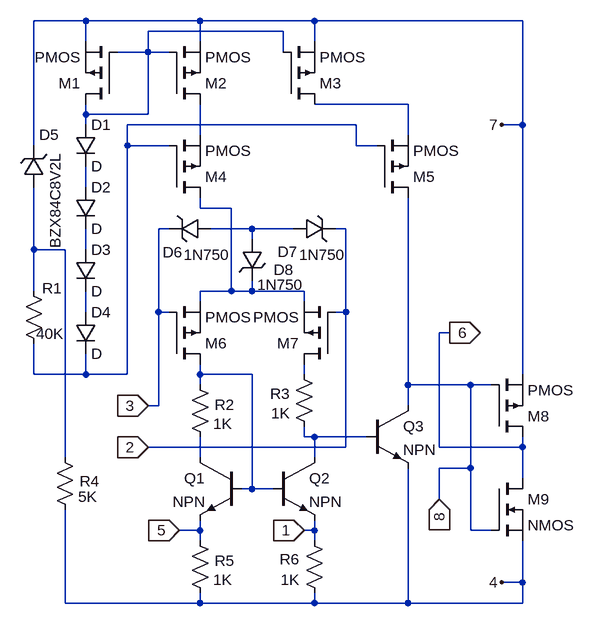
[diagram p0: schematic Ca3130.asc]
Ca3130.asc, the LTspice schematic file:
Version 4
SHEET 1 880 988
WIRE -224 256 -224 64
WIRE -224 416 -224 320
WIRE -224 480 -224 416
WIRE -224 608 -224 560
WIRE -176 416 -224 416
WIRE -176 736 -176 416
WIRE -176 960 -176 816
WIRE -144 64 -224 64
WIRE -144 96 -144 64
WIRE -144 208 -144 192
WIRE -144 224 -144 208
WIRE -144 320 -144 288
WIRE -144 416 -144 384
WIRE -144 512 -144 480
WIRE -144 608 -224 608
WIRE -144 608 -144 576
WIRE -80 256 -80 224
WIRE -80 608 -144 608
WIRE -80 608 -80 256
WIRE -48 112 -96 112
WIRE -48 112 -48 80
WIRE -48 208 -144 208
WIRE -48 208 -48 112
WIRE -32 512 -32 384
WIRE -32 656 -48 656
WIRE -32 656 -32 512
WIRE -16 112 -48 112
WIRE -16 256 -80 256
WIRE -16 384 -32 384
WIRE -16 512 -32 512
WIRE 32 64 -144 64
WIRE 32 96 32 64
WIRE 32 240 32 192
WIRE 32 352 32 336
WIRE 32 496 32 480
WIRE 32 608 32 592
WIRE 32 624 32 608
WIRE 32 736 32 704
WIRE 32 848 0 848
WIRE 32 848 32 832
WIRE 32 864 32 848
WIRE 32 960 -176 960
WIRE 32 960 32 944
WIRE 80 352 32 352
WIRE 80 480 32 480
WIRE 80 480 80 352
WIRE 112 384 48 384
WIRE 112 400 112 384
WIRE 112 480 80 480
WIRE 112 480 112 464
WIRE 112 608 32 608
WIRE 112 784 96 784
WIRE 112 784 112 608
WIRE 144 784 112 784
WIRE 160 80 -48 80
WIRE 160 112 160 80
WIRE 176 384 112 384
WIRE 192 480 112 480
WIRE 192 496 192 480
WIRE 192 608 192 592
WIRE 192 704 192 688
WIRE 208 64 32 64
WIRE 208 96 208 64
WIRE 208 704 192 704
WIRE 208 736 208 704
WIRE 208 848 192 848
WIRE 208 848 208 832
WIRE 208 864 208 848
WIRE 208 960 32 960
WIRE 208 960 208 944
WIRE 256 384 240 384
WIRE 256 512 240 512
WIRE 256 512 256 384
WIRE 256 720 -48 720
WIRE 256 720 256 512
WIRE 272 224 -80 224
WIRE 272 256 272 224
WIRE 288 704 208 704
WIRE 304 256 272 256
WIRE 352 192 208 192
WIRE 352 240 352 192
WIRE 352 624 352 336
WIRE 352 656 352 624
WIRE 352 960 208 960
WIRE 352 960 352 752
WIRE 400 720 400 544
WIRE 400 800 400 752
WIRE 416 544 400 544
WIRE 448 624 352 624
WIRE 448 752 400 752
WIRE 448 752 448 624
WIRE 448 848 448 752
WIRE 480 624 448 624
WIRE 480 848 448 848
WIRE 528 64 208 64
WIRE 528 224 496 224
WIRE 528 224 528 64
WIRE 528 608 528 224
WIRE 528 720 400 720
WIRE 528 720 528 704
WIRE 528 768 528 720
WIRE 528 928 496 928
WIRE 528 928 528 864
WIRE 528 960 352 960
WIRE 528 960 528 928
FLAG -48 656 3
IOPIN -48 656 In
FLAG -48 720 2
IOPIN -48 720 In
FLAG 0 848 5
IOPIN 0 848 In
FLAG 192 848 1
IOPIN 192 848 In
FLAG 400 800 8
IOPIN 400 800 In
FLAG 496 928 4
FLAG 496 224 7
FLAG 416 544 6
IOPIN 416 544 Out
SYMBOL zener -208 320 R180
WINDOW 0 -23 81 Left 0
WINDOW 3 -17 -94 VRight 0
SYMATTR InstName D5
SYMATTR Value BZX84C8V2L
SYMBOL res -208 576 R180
WINDOW 0 -12 116 Bottom 0
WINDOW 3 -9 15 Top 0
SYMATTR InstName R1
SYMATTR Value 40K
SYMATTR SpiceLine tol=1 pwr=0.1
SYMBOL zener 48 368 R90
WINDOW 0 68 58 VBottom 0
WINDOW 3 40 6 VTop 0
SYMATTR InstName D6
SYMATTR Value 1N750
SYMBOL zener 176 400 R270
WINDOW 0 -35 -9 VTop 0
WINDOW 3 -8 44 VBottom 0
SYMATTR InstName D7
SYMATTR Value 1N750
SYMBOL zener 96 400 R0
WINDOW 0 49 47 Left 0
WINDOW 3 24 70 Left 0
SYMATTR InstName D8
SYMATTR Value 1N750
SYMBOL res 16 608 R0
WINDOW 0 38 47 Left 0
SYMATTR InstName R2
SYMATTR Value 1K
SYMATTR SpiceLine tol=1 pwr=0.1
SYMBOL res 176 592 R0
WINDOW 0 -36 46 Left 0
WINDOW 3 -35 76 Left 0
SYMATTR InstName R3
SYMATTR Value 1K
SYMATTR SpiceLine tol=1 pwr=0.1
SYMBOL res -192 720 R0
WINDOW 0 39 52 Left 0
SYMATTR InstName R4
SYMATTR Value 5K
SYMATTR SpiceLine tol=1 pwr=0.1
SYMBOL npn2 144 736 R0
SYMATTR InstName Q2
SYMBOL npn2 96 736 M0
SYMATTR InstName Q1
SYMBOL res 16 848 R0
WINDOW 0 38 47 Left 0
SYMATTR InstName R5
SYMATTR Value 1K
SYMATTR SpiceLine tol=1 pwr=0.1
SYMBOL res 192 848 R0
WINDOW 0 -38 44 Left 0
WINDOW 3 -36 76 Left 0
SYMATTR InstName R6
SYMATTR Value 1K
SYMATTR SpiceLine tol=1 pwr=0.1
SYMBOL npn2 288 656 R0
SYMATTR InstName Q3
SYMBOL diode -160 224 R0
SYMATTR InstName D1
SYMBOL diode -160 320 R0
SYMATTR InstName D2
SYMBOL diode -160 416 R0
SYMATTR InstName D3
SYMBOL diode -160 512 R0
SYMATTR InstName D4
SYMBOL pmos -96 192 R180
SYMATTR InstName M1
SYMBOL pmos -16 192 M180
SYMATTR InstName M2
SYMBOL pmos 160 192 M180
SYMATTR InstName M3
SYMBOL pmos -16 336 M180
SYMATTR InstName M4
SYMBOL pmos 304 336 M180
SYMATTR InstName M5
SYMBOL pmos -16 592 M180
SYMATTR InstName M6
SYMBOL pmos 240 592 R180
SYMATTR InstName M7
SYMBOL pmos 480 704 M180
SYMATTR InstName M8
SYMBOL nmos 480 768 R0
SYMATTR InstName M9

The netlist it stands for:
* Ca3130.asc
D5 N001 7 BZX84C8V2L
R1 N002 N001 40K tol=1 pwr=0.1
D6 N011 3 1N750
D7 N011 2 1N750
D8 N011 N008 1N750
R2 N009 N010 1K tol=1 pwr=0.1
R3 N012 N013 1K tol=1 pwr=0.1
R4 N001 4 5K tol=1 pwr=0.1
Q2 N013 N009 1 0 NPN
Q1 N010 N009 5 0 NPN
R5 5 4 1K tol=1 pwr=0.1
R6 1 4 1K tol=1 pwr=0.1
Q3 8 N013 4 0 NPN
D1 N003 N004 D
D2 N004 N005 D
D3 N005 N006 D
D4 N006 N002 D
M1 N003 N003 7 7 PMOS
M2 N007 N003 7 7 PMOS
M3 N014 N003 7 7 PMOS
M4 N008 N002 N007 N007 PMOS
M5 8 N002 N014 N014 PMOS
M6 N009 3 N008 N008 PMOS
M7 N012 2 N008 N008 PMOS
M8 6 8 7 7 PMOS
M9 6 8 4 4 NMOS
.model D D
.lib standard.dio
.model NPN NPN
.model PNP PNP
.lib standard.bjt
.model NMOS NMOS
.model PMOS PMOS
.lib standard.mos
.backanno
.end